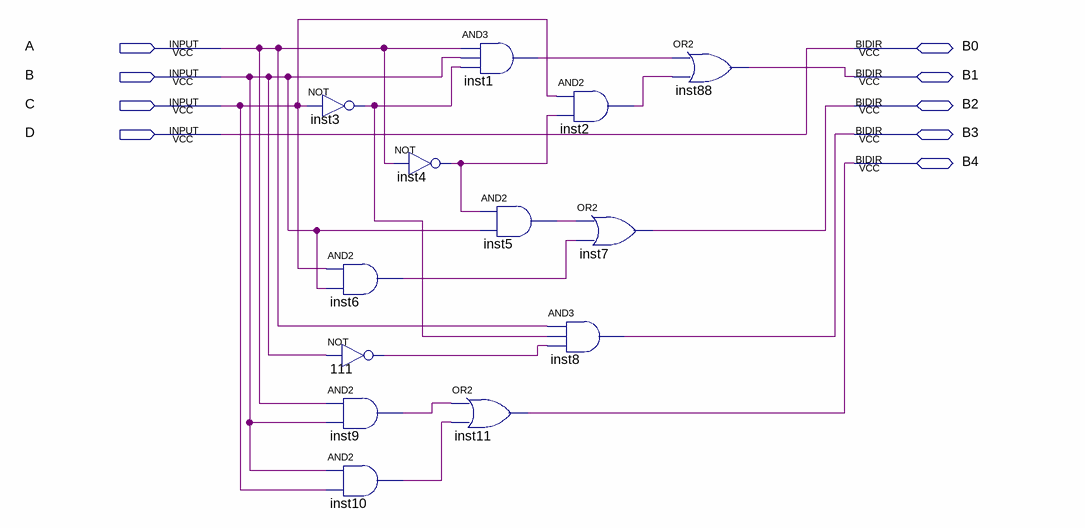
[diagram p0: schematic sheet]
// Quartus schematic 4BitBCD.bdf as structural Verilog: 13 symbols, 9 pins
module \4BitBCD  (
  input  A,
  input  B,
  input  C,
  input  D,
  inout  B0,
  inout  B1,
  inout  B2,
  inout  B3,
  inout  B4
);

  wire inst1_out, inst2_out, inst3_out, inst4_out, inst5_out, inst6_out, inst9_out, inst10_out, n111_out;

  not inst3 (inst3_out, C);
  and inst6 (inst6_out, C, B);
  not u_111 (n111_out, B);
  and inst9 (inst9_out, A, B);
  and inst10 (inst10_out, B, C);
  and inst1 (inst1_out, A, B, inst3_out);
  not inst4 (inst4_out, A);
  or inst11 (B4, inst9_out, inst10_out);
  and inst5 (inst5_out, inst4_out, B);
  and inst2 (inst2_out, C, inst4_out);
  or inst7 (B2, inst5_out, inst6_out);
  and inst8 (B3, A, inst3_out, n111_out);
  or inst88 (B1, inst1_out, inst2_out);

  assign B0 = D;
endmodule
